# EAGLE design PCB-JOY-RCP (EAGLE 7.7.0)
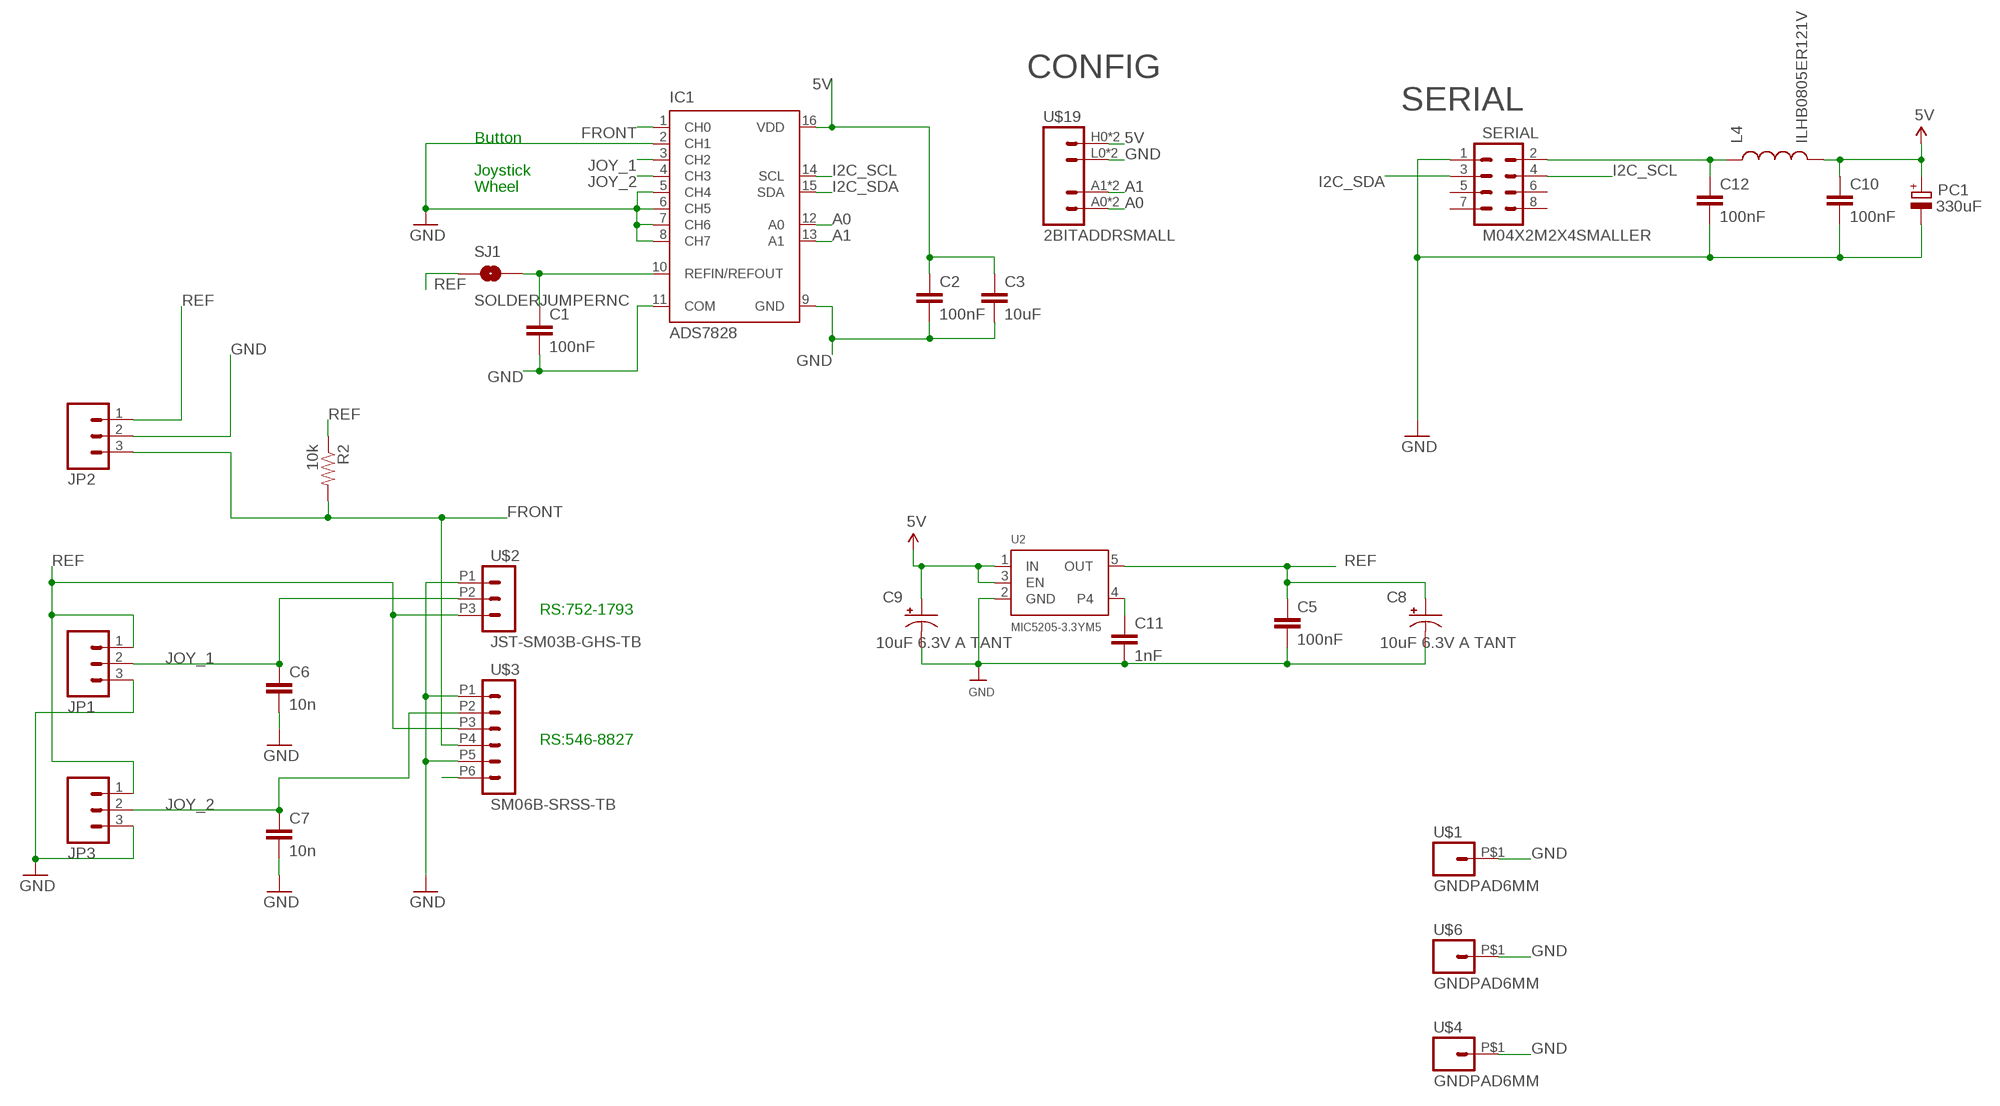
[diagram p0: schematic, sheet 1]

## Parts
C1  100nF  CAP0603-CAP  [0603-CAP]
C2  100nF  CAP0603-CAP  [0603-CAP]
C3  10uF  CAP0805  [0805]
C5  100nF  CAP0603-CAP  [0603-CAP]
C6  10n  CAP0603-CAP  [0603-CAP]
C7  10n  CAP0603-CAP  [0603-CAP]
C8  10uF 6.3V A TANT  CAP_POL1206  [EIA3216]
C9  10uF 6.3V A TANT  CAP_POL1206  [EIA3216]
C10  100nF  CAP0603-CAP  [0603-CAP]
C11  1nF  CAP0603-CAP  [0603-CAP]
C12  100nF  CAP0603-CAP  [0603-CAP]
IC1  ADS7828  [TSSOP16-PW]
JP1  M03PTH  [1X03]
JP2  M03PTH  [1X03]
JP3  M03PTH  [1X03]
L4  ILHB0805ER121V  INDUCTOR0805  [0805]
PC1  330uF  CPOL-EUD  [PANASONIC_D]
R2  10k  RESISTOR0603-RES  [0603-RES]
SERIAL  M04X2M2X4SMALLER  [M2X4SMALLER]
SJ1  SOLDERJUMPERNC  [SJ_2S]
U2  MIC5205-3.3YM5  VREG_SOT23-5  [SOT23-5]
U$1  GNDPAD6MM  [3.2MMPAD6MM]
U$2  JST-SM03B-GHS-TB  [JST-SM03B-GHS-TB]
U$3  SM06B-SRSS-TB  [JST-SM06B-SRSS-TB]
U$4  GNDPAD6MM  [3.2MMPAD6MM]
U$6  GNDPAD6MM  [3.2MMPAD6MM]
U$19  2BITADDRSMALL  [2BITADDR_SMALL]

## Nets
5V [Power]: C2.1 C3.1 C9.A(+) C10.1 IC1.16(VDD) L4.2 PC1.+ U2.1(IN) U2.3(EN) U$19.H0(VCC) U$19.H1(VCC)
A0: IC1.12(A0) U$19.A0(A1) U$19.AS0(A1)
A1: IC1.13(A1) U$19.A1(A2) U$19.AS1(A2)
ARD_5V [Power]: C12.1 L4.1 SERIAL.2
FRONT: IC1.1(CH0) JP2.3 R2.2 U$3.P4
GND [Power]: C1.2 C2.2 C3.2 C5.2 C6.2 C7.2 C8.C(-) C9.C(-) C10.2 C11.2 C12.2 IC1.2(CH1) IC1.5(CH4) IC1.6(CH5) IC1.7(CH6) IC1.8(CH7) IC1.9(GND) IC1.11(COM) JP1.3 JP2.2 JP3.3 PC1.- SERIAL.1 U2.2(GND) U$1.P$1 U$2.P1 U$3.P1 U$3.P5 U$4.P$1 U$6.P$1 U$19.L0(GND) U$19.L1(GND)
I2C_SCL: IC1.14(SCL) SERIAL.4
I2C_SDA: IC1.15(SDA) SERIAL.3
JOY_1: C6.1 IC1.3(CH2) JP1.2 U$2.P2
JOY_2: C7.1 IC1.4(CH3) JP3.2 U$3.P2
N$1: C1.1 IC1.10(REFIN/REFOUT) SJ1.2
N$2: C11.1 U2.4
N$11: U$3.P6
REF [Power]: C5.1 C8.A(+) JP1.1 JP2.1 JP3.1 R2.1 SJ1.1 U2.5(OUT) U$2.P3 U$3.P3
Unconnected: SERIAL.5 SERIAL.6 SERIAL.7 SERIAL.8

## Notes on the sheet
- CONFIG
- SERIAL
- Button
- Joystick
- Wheel
- RS:752-1793
- RS:546-8827

## Library data of the parts
C1-C3 C5-C7 C10-C12 = SparkFun:CAP: Capacitor Standard 0603 ceramic capacitor, and 0.1" leaded capacitor.
C8 C9 = freetronics:CAP_POL: Capacitor Polarized These are standard SMD and PTH capacitors. Normally 10uF, 47uF, and 100uF in electrolytic and tantalum varieties. Always verify the external diameter of the through hole cap, it varies with capacity, voltage, and manufacturer. The EIA devices should be standard.
IC1 = burr-brown:ADS7828: 12-Bit, 8-Channel Sampling ANALOG-TO-DIGITAL CONVERTER with I2C? Interface Source: www.ti.com .. ADS7828.pdf; MF: TEXAS INSTRUMENTS; MPN: ADS7828E/250; OC_FARNELL: 1470338; OC_NEWARK: 74C7158
JP1-JP3 = SparkFun:M03: Header 3 Standard 3-pin 0.1" header. Use with straight break away headers (SKU : PRT-00116), right angle break away headers (PRT-00553), swiss pins (PRT-00743), machine pins (PRT-00117), and female headers (PRT-00115). Molex polarized connector foot print use with SKU : PRT-08232 with associated crimp pins and housings.
L4 = SparkFun:INDUCTOR: Inductors Basic Inductor/Choke - 0603 and 1206. Footprints are not proven and vary greatly between part numbers.
PC1 = rcl:CPOL-EU: POLARIZED CAPACITOR, European symbol
R2 = SparkFun:RESISTOR: Resistor Basic schematic elements and footprints for 0603, 1206, and PTH resistors.
SERIAL = SKAARHOJ:M04X2
SJ1 = SparkFun:SOLDERJUMPER: Solder Jumper Standard SMD solder jumper. Used to automate production. Two varients : Normally Open and Normally Closed are the same, but have different paste layers. NC will have a large amount of paste and should jumper during reflow.
U2 = microbuilder:VREG_SOT23-5: SOT23-5 Fixed Voltage Regulators To better organise some of the SOT23-5 fixed voltage regulators in this library, this new part was created. Part Current Out V Out V In V Dropout Digikey Part No. ADP121 150mA 3.3V 3.4-5.5V 0.09V @ 150mA ADP121-AUJZ33R7CT-ND ADP121 150mA 3.0V 3.1-5.5V 0.09V @ 150mA ADP121-AUJZ30R7CT-ND ADP122 300mA 3.3V 3.4-5.5V 0.085V @ 300mA ADP122AUJZ-3.3-R7CT-ND ADP1712 300mA 3.3V 3.5-5.5V 0.17V @ 300mA ADP1712AUJZ-3.3-R7TR-ND AP7311 (Low Cost) 150mA 3.3V 3.5-6V 0.15V @ 150mA AP7311-33WG-7DICT-ND LD39015M18R 150mA 1.8V 1.9V-5.5V 0.08V @ 100mA 497-6977-1-ND MCP1824T-3302E/OT 300mA 3.3V 3.5V-6V 0.2V @ 300mA MCP1824T-3302E/OTCT-ND MIC5205-2.5YM5 TR 150mA 2.5V 2.7-16V 0.165V @ 150mA 576-1257-2-ND MIC5205-3.0YM5 TR 150mA 3.0V 3.2V-16V 0.165V @ 150mA 576-1258-2-ND MIC5205-3.3YM5 TR 150mA 3.3V 3.5V-16V 0.165V @ 150mA 576-1259-2-ND TPS780330220 150mA 3.3V+2.2V 3.6-5.5V 250mV Max 296-23332-1-ND TDA3663/N1,135 100mA 3.3V 3.5-45V 0.18V @ 50mA 568-5343-1-ND
U$1 U$4 U$6 = SKAARHOJ:GNDPAD
U$2 = SKAARHOJ:JST-SM03B-GHS-TB
U$3 = SKAARHOJ:SM06B-SRSS-TB
U$19 = SKAARHOJ:2BITADDR

## Net classes
0 default: width 0.203 mm, drill 0.406 mm, clearance 0.203 mm
1 Power: width 0.305 mm, drill 0.61 mm, clearance 0.203 mm

## Board
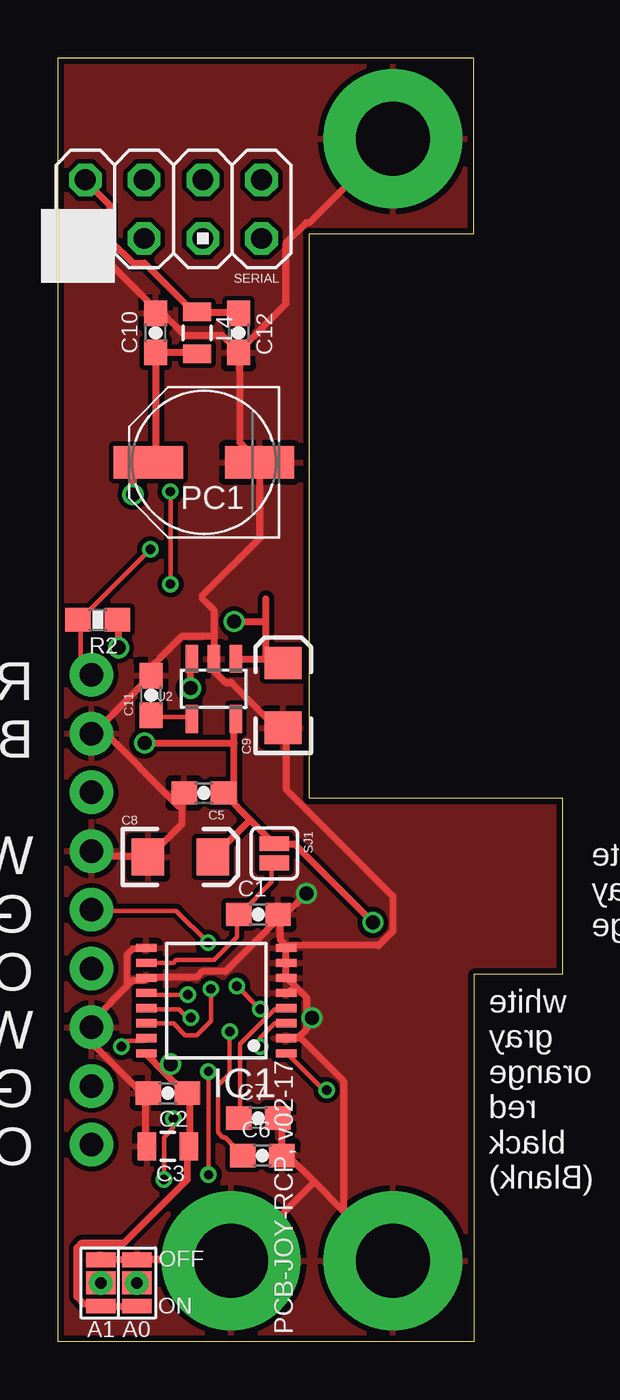
[diagram p1: board, top side]
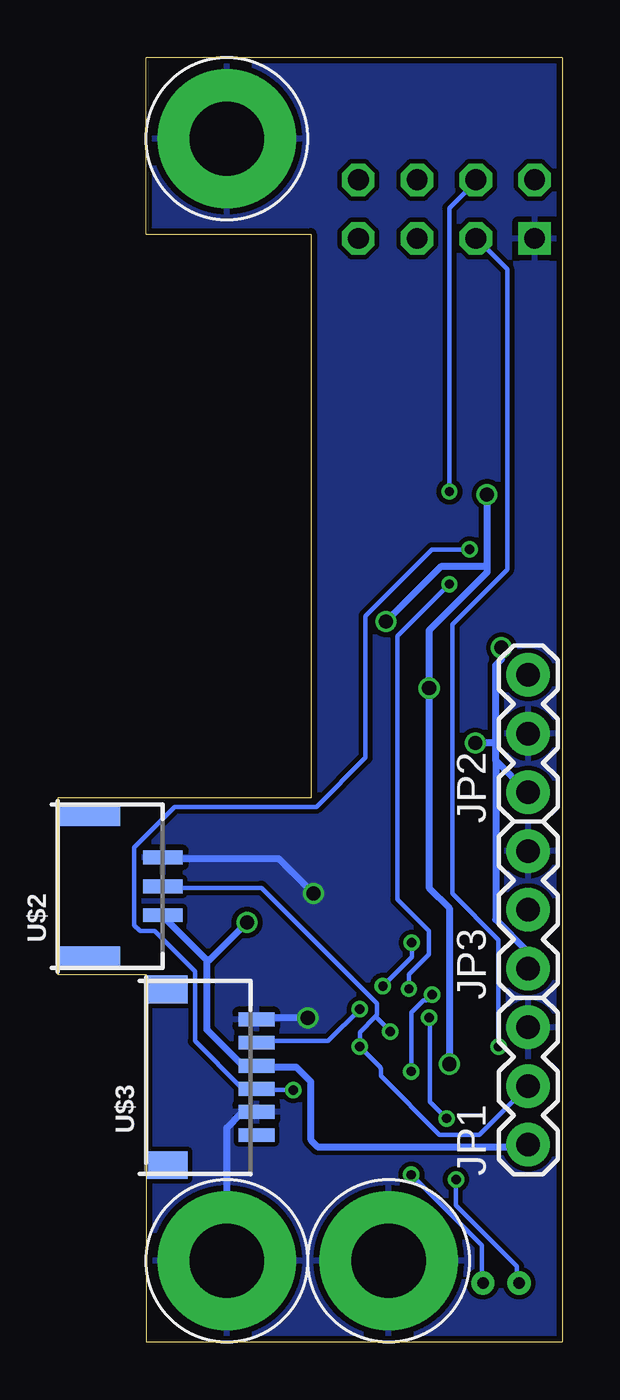
[diagram p2: board, bottom side, seen from below]

Size 21.81 x 55.5 mm. Coordinates in mm from the lower left corner, seen from the top.
Outline: 0,55.5 18,55.5 18,47.88 10.86,47.88 10.86,23.5 21.81,23.5 21.81,15.88 18,15.88 18,0 0,0 0,55.5
Copper layers (1*16): Top 0.035mm / dielectric 1.5mm / Bottom 0.035mm
Design rules "Fusion_eagle_rule_v1.1": minimum track width 6mil, minimum drill 12mil, track to track 6mil, track to pad 6mil, pad to pad 6mil, via to via 6mil, smd to smd 0mil, copper to edge 10mil, drill to drill 10mil, minimum pad ring 10mil, minimum via ring 6mil, stop-mask expansion 2mil, vias tented up to drill 100mil, thermal gap 10mil

### Footprints (pad centres in the part's own frame; a part is rotated, then mirrored left to right if it is on the bottom)
0603-CAP = smd 1.1 x 1: 1 -0.85,0; 2 0.85,0
0805 = smd 0.8 x 1.2: 1 -0.9,0; 2 0.9,0
EIA3216 = smd 1.4 x 1.6: A 1.4,0; C -1.4,0
TSSOP16-PW = smd 0.35 x 0.9: 1 -2.275,-3.025; 2 -1.625,-3.025; 3 -0.975,-3.025; 4 -0.325,-3.025; 5 0.325,-3.025; 6 0.975,-3.025; 7 1.625,-3.025; 8 2.275,-3.025; 9 2.275,3.025; 10 1.625,3.025; 11 0.975,3.025; 12 0.325,3.025; 13 -0.325,3.025; 14 -0.975,3.025; 15 -1.625,3.025; 16 -2.275,3.025
1X03 = drill 1.016 pad 1.88: 1 0,0; 2 2.54,0; 3 5.08,0
PANASONIC_D = smd 3 x 1.4: + 2.4,0; - -2.4,0
0603-RES = smd 1.1 x 1: 1 -0.85,0; 2 0.85,0
M2X4SMALLER = drill 0.9 square: 1 -1.27,3.81 | drill 0.9 octagon: 2 1.27,3.81; 3 -1.27,1.27; 4 1.27,1.27; 5 -1.27,-1.27; 6 1.27,-1.27; 7 -1.27,-3.81; 8 1.27,-3.81
SJ_2S = smd 0.635 x 1.27: 1 -0.412,0; 2 0.412,0
SOT23-5 = smd 0.55 x 1.2: 1 -0.95,-1.3; 2 0,-1.3; 3 0.95,-1.3; 4 0.95,1.3; 5 -0.95,1.3
3.2MMPAD6MM = drill 3.2 pad 6: P$1 0,0
JST-SM03B-GHS-TB = smd 0.6 x 1.7: P1 -1.25,4.55; P2 0,4.55; P3 1.25,4.55 | smd 1 x 2.7: SUPPORT1 -3.1,1.35; SUPPORT2 3.1,1.35
JST-SM06B-SRSS-TB = smd 0.6 x 1.55: P1 -2.5,4.78; P2 -1.5,4.78; P3 -0.5,4.78; P4 0.5,4.78; P5 1.5,4.78; P6 2.5,4.78 | smd 1.2 x 1.8: SUPPORT1 -3.8,0.9; SUPPORT2 3.8,0.9
2BITADDR_SMALL = drill 0.5: A0 -1.565,0; A1 0,0 | smd 1.27 x 1: AS0 -1.565,0; AS1 0,0 | smd 1.27 x 0.635: H0 -1.565,1; H1 0,1; L0 -1.565,-1; L1 0,-1

### Placement (x,y rotation side)
C1  8.68,18.46 0 top
C2  4.76,10.74 180 top
C3  4.76,8.45 180 top
C5  6.31,23.72 180 top
C6  8.85,8.04 0 top
C7  8.67,9.66 0 top
C8  5.3,20.95 0 top
C9  9.75,27.94 90 top
C10  4.23,43.61 90 top
C11  4.03,27.94 90 top
C12  7.82,43.61 270 top
IC1  6.86,14.74 90 top
JP1  1.46,8.51 90 bottom
JP2  1.46,23.75 90 bottom
JP3  1.46,16.13 90 bottom
L4  6.03,43.61 270 top
PC1  6.32,38.01 180 top
R2  1.73,31.2 180 top
SERIAL  5,48.96 90 top
SJ1  9.37,21.11 270 top
U2  6.75,28.22 180 top
U$1  14.5,3.5 180 bottom
U$2  21.81,19.68 270 bottom
U$3  18,11.43 270 bottom
U$4  7.5,3.5 0 bottom
U$6  14.5,52 180 bottom
U$19  1.86,2.54 180 top

### Tracks (layer width: path | path; a pad name or v marks a point on that pad's centre or on a via)
5V  (via drill 0.61)
  Top 0.305: 4.56,11.69 5.5,10.75 C2.1 | 4.56,11.69 3.88,12.38 IC1.16 | 5.62,10.62 C2.1 | U2.1 7.75,29.5 9.5,29.5 9.62,29.38 C9.A 9,29.62 9,31.12 | 9,31.12 9,32.12 | L4.2 6,42.75 4.25,42.75 C10.1 4.25,42.62 4.25,38.38 4,38.12 PC1.+ 3.88,38 3.25,37.38 v3.25,36.62 | v5.75,28.25 5.75,29.5 U2.3 | v7.62,31.12 9,31.12 | v4.88,12 4.56,11.69 | C2.1 5.71,10.57 5.71,8.53 C3.1 5.61,8.33 5.61,7.01 2.86,4.27 1.03,4.27 0.83,4.06 0.83,1.93 1.13,1.63 1.74,1.63 U$19.H1 1.95,1.52 3.37,1.52 U$19.H0
  Bottom 0.305: v3.25,36.62 3.25,33.5 | 3.25,33.5 3.25,33.25 5.75,30.75 v5.75,28.25 5.75,19.62 4.88,18.75 v4.88,12 | v7.62,31.12 5.25,33.5 3.25,33.5
A0  (via drill 0.41)
  Top 0.203: v5.62,15 3.88,15 IC1.12 | 3.37,2.54 U$19.AS0 | v6.52,7.21 v6.52,11.68
  Bottom 0.203: v5.62,15 5.88,14.75 6,14.75 6.5,14.25 6.52,14.22 v6.52,11.68 | v6.52,7.21 3.47,4.17 3.47,2.54 U$19.AS0
A1  (via drill 0.41)
  Top 0.203: v5.75,14 5.62,14 5.25,14.38 3.88,14.38 IC1.13 | 1.85,2.54 U$19.AS1 | v5,9.65 5,9.25 4.59,8.84 v4.59,7.01
  Bottom 0.203: v5,9.65 5.71,10.36 5.71,13.92 v5.75,14 | v4.59,7.01 4.59,5.89 1.95,3.25 1.95,2.54 U$19.AS1
ARD_5V
  Top 0.305: C12.1 7.75,44.5 6.12,44.5 L4.1 5.88,44.5 3.75,46.62 3.25,46.62 2.25,47.62 2.25,49.12 1.25,50.12 SERIAL.2
FRONT  (via drill 0.41)
  Top 0.203: v11.62,10.88 11.5,10.88 10,12.38 IC1.1 | JP2.3 1.38,28.88 1,29.25 1,31.12 R2.2 1,31.25 v4,34.25
  Bottom 0.203: v11.62,10.88 13.12,10.88 U$3.P4 13.25,11 13.88,11 15.88,13 15.88,16 17.62,17.75 18.25,17.75 18.5,18 18.5,21.38 16.75,23.12 10.62,23.12 8.5,25.25 8.5,31.38 5.62,34.25 v4,34.25
GND  (via drill 0.61)
  Top 0.305: 3.06,15.44 1.5,13.88 1.5,13.62 JP1.3 1.5,13.5 1.5,12.88 3.75,10.62 C2.2 | 3.06,15.44 3.25,15.62 3.75,15.62 IC1.11 3.88,15.75 6,15.75 6.25,16 7.25,16 9.5,18.25 C1.2 | IC1.9 3.75,17 3.25,17 3,16.75 3,15.5 3.06,15.44 | 3.88,10.62 C2.2 | 10.38,13.12 10,13.12 IC1.2 | 10.38,13.12 10.75,13.5 10.75,14 | 10.75,14 10.75,14.88 10.25,15.38 | 10.25,15.38 10,15.62 IC1.6 9.88,15.75 9.88,16.25 IC1.7 9.88,16.5 9.88,17 IC1.8 | 10.25,15.38 10,15.12 IC1.5 | C1.2 9.62,18.38 9.62,17.38 9.88,17.12 IC1.8 | v11,14 10.75,14 | v10.75,19.38 9.75,18.38 C1.2 | 9.62,9.62 C7.2 9.67,9.55 9.67,8.13 C6.2 9.77,8.03 9.87,8.03 10,8 11.09,6.91 | U$1.P$1 12.31,5.69 | 12.31,5.69 11.09,6.91 | 10.38,13.12 10.5,13.12 12.38,11.25 12.38,5.75 12.31,5.69 | SERIAL.1 1.25,47.62 4.12,44.75 4.12,44.5 C10.2 4.25,44.38 4.62,44.38 5.5,43.5 7.12,43.5 7.75,42.88 C12.2 | C12.2 7.88,42.75 7.88,38.88 8.62,38.12 PC1.- 8.75,37.88 8.75,34.75 6.25,32.25 | 6.75,30.5 6.75,31.62 6.25,32.12 | 6.75,30.5 U2.2 6.75,29 7.25,28.5 7.5,28.5 9.38,26.62 9.62,26.62 C9.C 9.88,26.5 9.88,23.88 14.5,19.25 14.5,17.75 13.88,17.12 10,17.12 IC1.8 | 5.38,23.12 5.38,22.38 4,21 C8.C 3.88,21 1.62,21 1.5,21.12 JP3.3 | 5.38,23.12 5.38,23.62 C5.2 | 5.38,23.12 5.25,23.12 1.88,26.5 JP2.2 1.5,26.25 4,28.75 C11.2 4.12,28.88 4.12,29.25 5.38,30.5 6.75,30.5 | U$6.P$1 10.88,48.38 10.75,48.38 9.88,47.5 9.88,44.88 7.88,42.88 C12.2 | C3.2 3.78,8.53 3.78,10.57 C2.2 | U$19.L1 1.95,3.56 3.37,3.56 U$19.L0 3.57,3.56 7.43,3.56 U$4.P$1 7.64,3.45 11.09,6.91
  Bottom 0.305: v11,14 13.12,14 U$3.P1 | v10.75,19.38 12.25,20.88 17.25,20.88 U$2.P1 | U$1.P$1 14.5,9.25 13.88,9.88 13.25,9.88 U$3.P5
  pour Bottom: 21.81,0 0.22,0 0.22,55.24 21.81,55.24
  pour Top: 21.81,0 0.22,0 0.22,55.24 21.81,55.24
I2C_SCL  (via drill 0.41)
  Top 0.203: v6.62,15.25 6.62,13.88 6,13.25 5.5,13.25 5,13.75 3.88,13.75 IC1.14 | v4.88,36.75 v4.88,32.75
  Bottom 0.203: v6.62,15.25 6.62,15.88 5.75,16.75 5.75,17.75 7.12,19.12 7.12,30.5 v4.88,32.75 | v4.88,36.75 4.88,49 3.75,50.12 SERIAL.4
I2C_SDA  (via drill 0.41)
  Top 0.203: v2.75,12.75 3,13 3.75,13 IC1.15
  Bottom 0.203: v2.75,12.75 2.75,17.38 4.75,19.38 4.75,31 2.38,33.38 2.38,46.38 3.62,47.62 SERIAL.3
JOY_1  (via drill 0.41)
  Top 0.203: v8.75,12.75 8.75,13.12 9.38,13.75 9.88,13.75 IC1.3 | 1.5,10.25 1.5,11 JP1.2 | v7.43,13.41 7.43,11.58 6.93,11.07 6.93,9.04 7.13,8.84 7.23,8.84 7.94,8.13 C6.1
  Bottom 0.203: 8.07,14.05 8,14.12 8,14.62 13,19.62 17.25,19.62 U$2.P2 | 8.07,14.05 8.75,13.38 v8.75,12.75 7.88,11.88 7.84,11.79 7.84,11.48 5.3,8.94 3.57,8.94 1.54,10.97 JP1.2 | 8.07,14.05 v7.43,13.41
JOY_2  (via drill 0.41)
  Top 0.203: 9.06,14.06 7.88,12.88 7.88,9.75 C7.1 | 9.06,14.06 9.38,14.38 9.88,14.38 IC1.4 | 9.06,14.06 v8.75,14.38 v7.75,15.38 | v6.5,17.25 5.12,18.62 1.5,18.62 JP3.2
  Bottom 0.203: v8.75,14.38 10.12,13 13.12,13 U$3.P2 | v6.5,17.25 6.5,16.62 v7.75,15.38
N$1
  Top 0.203: IC1.10 3.88,16.38 5,16.38 5.12,16.5 6.75,16.5 7.75,17.5 7.75,18.38 C1.1 7.88,18.5 9.25,19.88 9.25,20.62 SJ1.2
N$2
  Top 0.203: C11.1 4.12,27 5.75,27 U2.4
REF  (via drill 0.61)
  Top 0.305: 8.31,22.56 9.25,21.62 SJ1.1 9.5,21.5 10.25,21.5 v13.62,18.12 | 8.31,22.56 7.25,23.62 C5.1 7.62,23.38 7.62,25.88 | 7.62,25.88 7.62,26.88 U2.5 | 8.31,22.56 6.75,21 C8.A | v2.62,30 2.62,31.12 R2.1 | v3.75,25.88 7.62,25.88
  Bottom 0.305: v2.62,30 2.62,29.5 2.88,29.25 2.88,25.88 | 2.88,25.12 2.88,25.88 | 2.88,25.12 1.5,23.75 JP2.1 | 2.88,25.12 2.88,18.25 1.5,16.88 1.5,16.25 JP3.1 | 2.88,25.88 v3.75,25.88 | 15.38,16.5 15.38,13.5 13.88,12 13.25,12 U$3.P3 13.12,11.88 11.5,11.88 10.88,11.25 10.88,8.75 10.79,8.64 10.58,8.43 1.54,8.43 JP1.1 | 15.38,16.5 17.25,18.38 U$2.P3 | v13.62,18.12 15.25,16.5 15.38,16.5

### Text on the board
_tsilk: white / gray / orange | white / gray / orange / red / black / (Blank) | RED / BLACK / / WHITE / GRAY / ORANGE / WHITE / GRAY / ORANGE | PCB-JOY-RCP, v02-17